# EAGLE design 180V_StepUp (EAGLE 9.6.2)

## Sheet 1 of 3
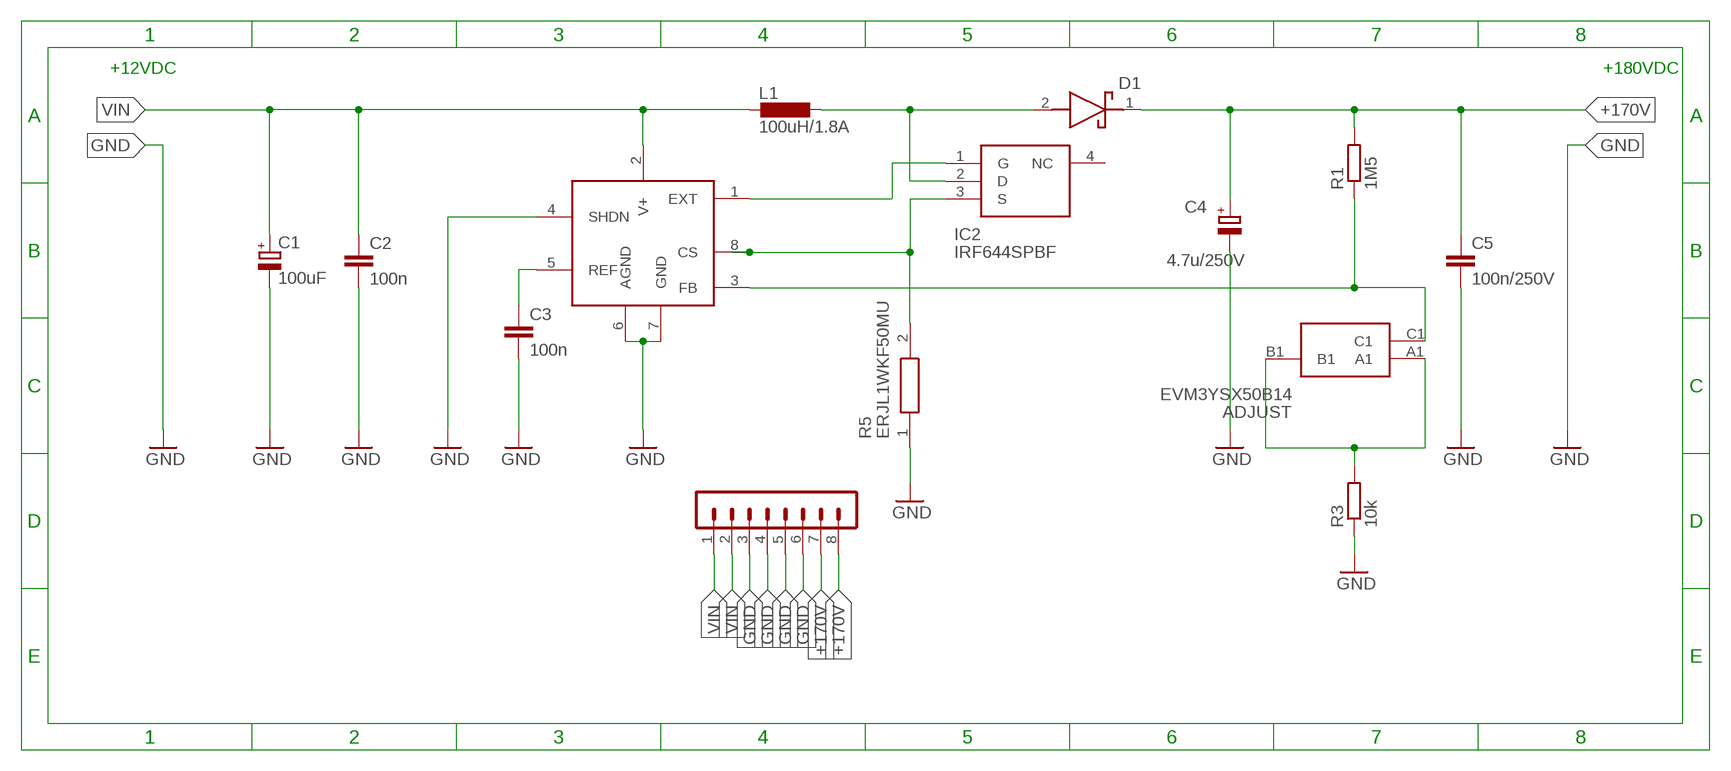
[diagram p0: schematic, sheet 1]

### Parts
ADJUST  EVM3YSX50B14  [EVM3YSX50B14]
C1  100uF  CPOL-EUE2-4  [E2-4]
C2  100n  C-EUC0805  [C0805]
C3  100n  C-EUC0805  [C0805]
C4  4.7u/250V  CPOL-EUE2.5-7  [E2,5-7]
C5  100n/250V  C-EUC2225K  [C2225K]
D1  LSM115JE3_TR13  [DIOM5436X330N]
IC1  MAX1771  [SO08]
IC2  IRF644SPBF  [TO254P1524X483-4N]
L1  100uH/1.8A  DO3316P  [DO3316P]
R1  1M5  R-EU_R0805  [R0805]
R3  10k  R-EU_R0805  [R0805]
R5  ERJL1WKF50MU  [RESC6432X120N]
SV1  PINHEADER-1X8  [MA08-1]

### Nets
+170V: C4.+ C5.1 D1.1(K) R1.2 SV1.7 SV1.8
GND: C1.- C2.2 C3.2 C4.- C5.2 IC1.4(SHDN) IC1.6(AGND) IC1.7(GND) R3.1 R5.1 SV1.3 SV1.4 SV1.5 SV1.6
N$2: D1.2(A) IC2.2(D) L1.2
N$3: C3.1 IC1.5(REF)
N$4: IC1.1(EXT) IC2.1(G)
N$5: IC1.8(CS) IC2.3(S) R5.2
N$6: ADJUST.C1 IC1.3(FB) R1.1
N$7: ADJUST.A1 ADJUST.B1 R3.2
VIN: C1.+ C2.1 IC1.2(V+) L1.1 SV1.1 SV1.2
Unconnected: IC2.4(NC)

### Notes on the sheet
- +12VDC | +180VDC

## Sheet 2 of 3
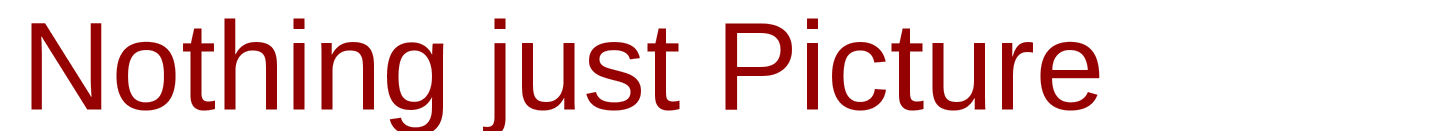
[diagram p1: schematic, sheet 2]

### Notes on the sheet
- Nothing just Picture

## Sheet 3 of 3

## Library data of the parts
ADJUST = CommonParts:EVM3YSX50B14: SMD Cermet Trimmer Pot, 3mm Sq, 10K Source: Datasheet; DESCRIPTION: SMD Cermet Trimmer Pot, 3mm Sq, 10K; HEIGHT: 1.55mm; MANUFACTURER_NAME: Panasonic; MANUFACTURER_PART_NUMBER: EVM3YSX50B14
C1 C4 = rcl:CPOL-EU: POLARIZED CAPACITOR, European symbol; SPICEPREFIX: C
C2 C3 C5 = rcl:C-EU: CAPACITOR, European symbol; SPICEPREFIX: C
D1 = CommonParts:LSM115JE3_TR13: Schottky Diodes & Rectifiers Schottky Source: Datasheet <https://componentsearchengine.com/Datasheets/1/LSM115JE3_TR13.pdf>; DESCRIPTION: Schottky Diodes & Rectifiers Schottky; HEIGHT: 3.3mm; MANUFACTURER_NAME: Microsemi Corporation; MANUFACTURER_PART_NUMBER: LSM115JE3/TR13; MOUSER_PART_NUMBER: 494-LSM115JE3/TR13; MOUSER_PRICE-STOCK: https://www.mouser.com/Search/Refine.aspx?Keyword=494-LSM115JE3%2FTR13
IC1 = nixie_clock:MAX1771
IC2 = MouserUseful:IRF644SPBF: IRF644SPBF, N-channel MOSFET Transistor 14 A 250 V, 3-Pin D2PAK Source: Datasheet <http://www.vishay.com/docs/91040/91040.pdf>; DESCRIPTION: IRF644SPBF, N-channel MOSFET Transistor 14 A 250 V, 3-Pin D2PAK; HEIGHT: 4.83mm; MANUFACTURER_NAME: Vishay; MANUFACTURER_PART_NUMBER: IRF644SPBF; MOUSER_PART_NUMBER: 844-IRF644SPBF; MOUSER_PRICE-STOCK: https://www.mouser.co.uk/ProductDetail/Vishay-Semiconductors/IRF644SPBF/?qs=cvaI6ThkwxsO%2F0AjDnaNgA%3D%3D
L1 = nixie_clock:DO3316P: COILCRAFT; OC_FARNELL: unknown; OC_NEWARK: unknown
R1 R3 = rcl:R-EU_: RESISTOR, European symbol; SPICEPREFIX: R
R5 = MouserUseful:ERJL1WKF50MU: RESISTOR, 2512 50 mOhm +/-1% 1W Source: Datasheet <http://componentsearchengine.com/Datasheets/1/ERJ-L1WKF50MU.pdf>; DESCRIPTION: RESISTOR, 2512 50 mOhm +/-1% 1W; HEIGHT: 1.2mm; MANUFACTURER_NAME: Panasonic; MANUFACTURER_PART_NUMBER: ERJL1WKF50MU
SV1 = CommonParts:PINHEADER-1X8: PIN HEADER; OC_FARNELL: unknown; OC_NEWARK: unknown

## Board
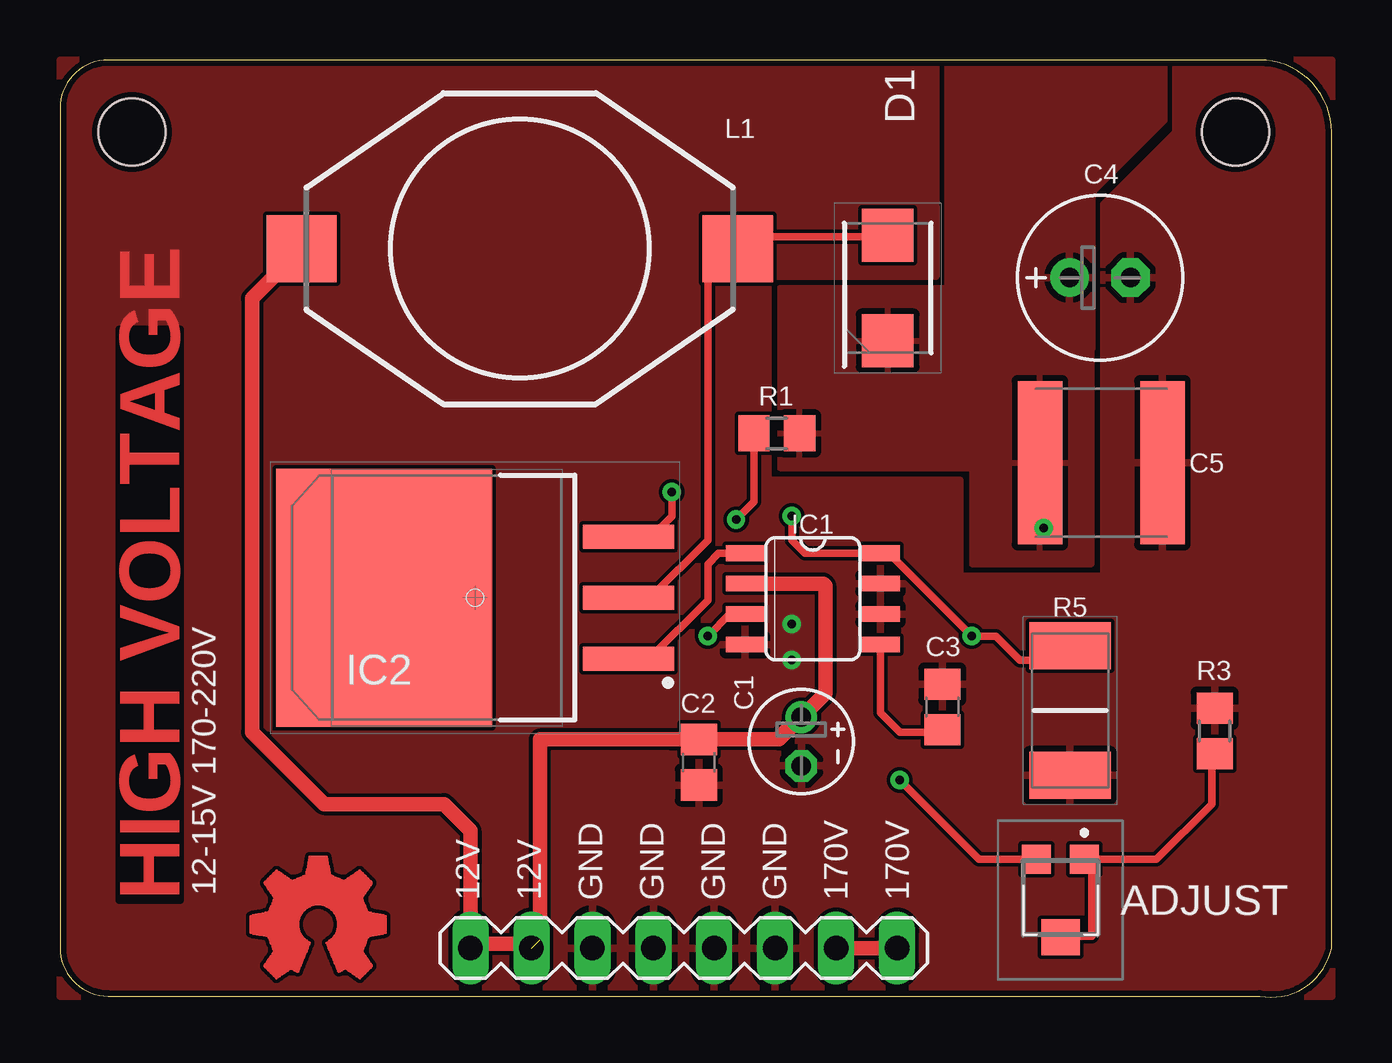
[diagram p2: board, top side]
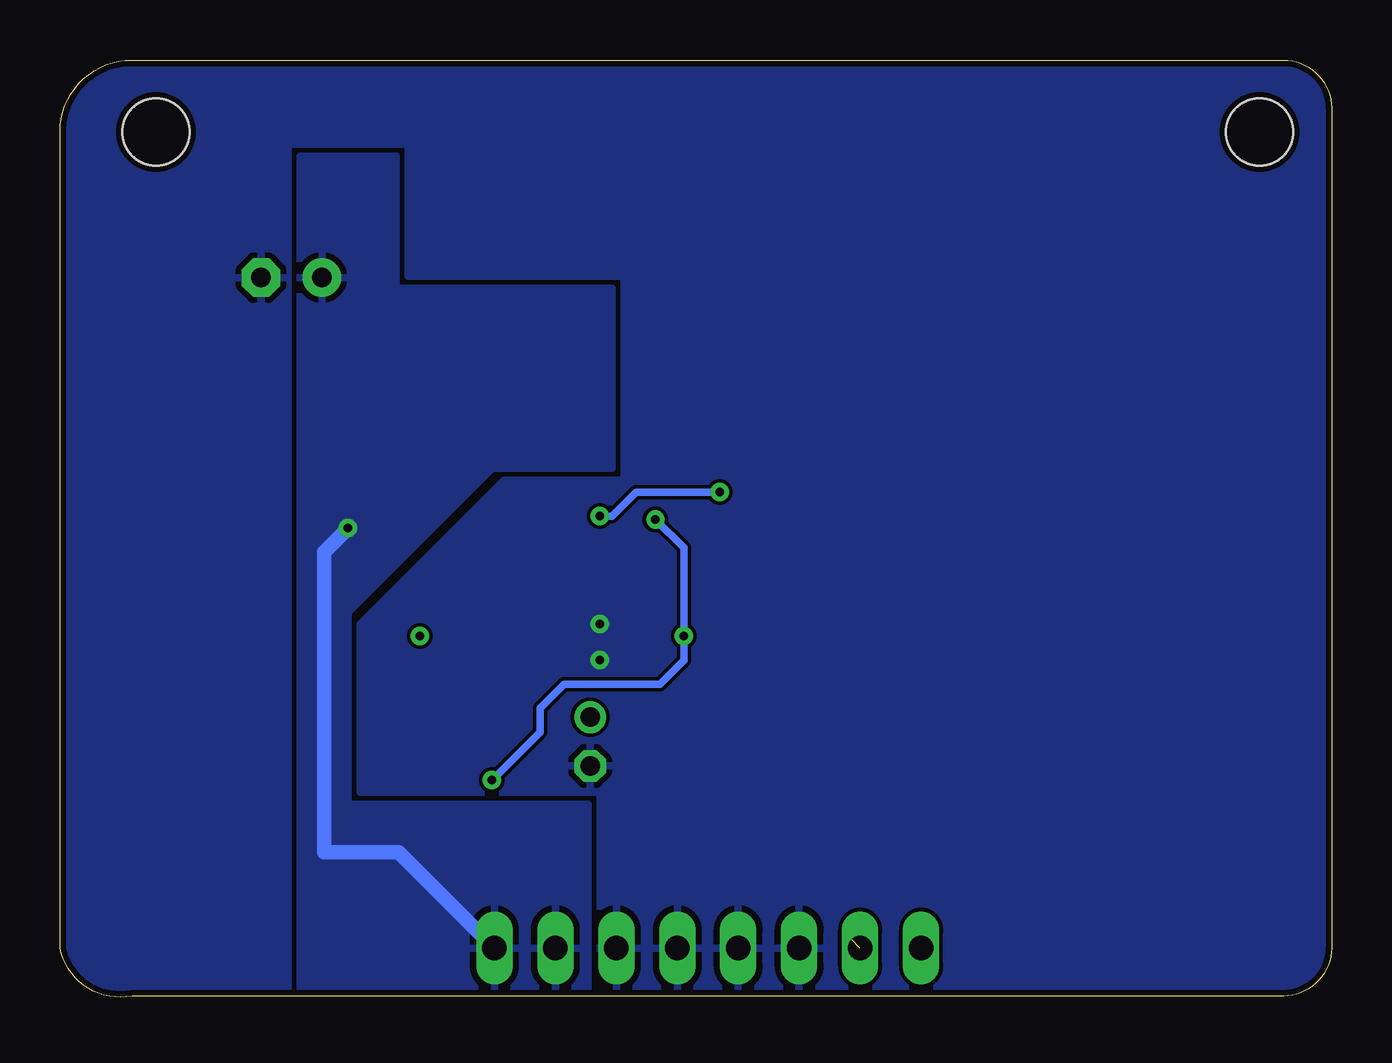
[diagram p3: board, bottom side, seen from below]

Size 53 x 39.05 mm. Coordinates in mm from the lower left corner, seen from the top.
Outline: 53,2.05 53,36.05 arc90 50,39.05 2,39.05 arc90 0,37.05 0,2.05 arc90 2,0.05 50,0.05 arc90 53,2.05
Copper layers (1*16): Top 0.035mm / dielectric 1.5mm / Bottom 0.035mm
Design rules "default *": minimum track width 6mil, minimum drill 0.35mm, track to track 6mil, track to pad 6mil, pad to pad 6mil, via to via 6mil, smd to smd 6mil, copper to edge 10mil, drill to drill 6mil, minimum pad ring 10mil, minimum via ring 8mil, stop-mask expansion 4mil, vias tented up to drill 0mil, thermal gap 10mil
Holes 2.8 mm at 3,36.05 49,36.05

### Footprints (pad centres in the part's own frame; a part is rotated, then mirrored left to right if it is on the bottom)
EVM3YSX50B14 = smd 1.2 x 1.2: A1 -1,-1.6; C1 1,-1.6 | smd 1.6 x 1.5: B1 0,1.65
E2-4 = drill 0.813 pad 1.27: + -1.016,0 | drill 0.813 pad 1.27 octagon: - 1.016,0
C0805 = smd 1.3 x 1.5: 1 -0.95,0; 2 0.95,0
E2,5-7 = drill 0.813 pad 1.6: + -1.27,0 | drill 0.813 pad 1.6 octagon: - 1.27,0
C2225K = smd 1.85 x 6.8: 1 -2.55,0; 2 2.55,0
DIOM5436X330N = smd 2.2 x 2.15: 1 -2.2,0; 2 2.2,0
SO08 = smd 0.66 x 1.6: 1 -1.905,-2.823; 2 -0.635,-2.823; 3 0.635,-2.823; 4 1.905,-2.823; 5 1.905,2.823; 6 0.635,2.823; 7 -0.635,2.823; 8 -1.905,2.823
TO254P1524X483-4N = smd 3.8 x 1: 1 -6.4,2.54; 2 -6.4,0; 3 -6.4,-2.54 | smd 9 x 10.75: 4 3.8,0
DO3316P = smd 2.92 x 2.79: 1 -9.09,0; 2 9.09,0
R0805 = smd 1.3 x 1.5: 1 -0.95,0; 2 0.95,0
RESC6432X120N = smd 1.95 x 3.4: 1 -2.7,0; 2 2.7,0
MA08-1 = drill 1.016 long: 1 -8.89,0; 2 -6.35,0; 3 -3.81,0; 4 -1.27,0; 5 1.27,0; 6 3.81,0; 7 6.35,0; 8 8.89,0

### Placement (x,y rotation side)
ADJUST  41.7,4.15 180 top
C1  30.9,10.65 270 top
C2  26.63,9.79 270 top
C3  36.78,12.09 90 top
C4  43.35,29.98 0 top
C5  43.4,22.27 0 top
D1  34.5,29.55 90 top
IC1  31.38,16.6 270 top
IC2  17.3,16.65 180 top
L1  19.16,31.19 0 top
R1  29.88,23.49 0 top
R3  48.13,11.09 270 top
R5  42.1,11.95 90 top
SV1  26,2.05 0 top

### Tracks (layer width: path | path; a pad name or v marks a point on that pad's centre or on a via)
+170V  (via drill 0.35)
  Top 0.61: SV1.7 SV1.8
  Bottom 0.61: SV1.8 38.89,6.05 42,6.05 42,18.55 v41,19.55
  pour Top: 30,29.55 30,22.05 38,22.05 38,18.05 43,18.05 43,29.55
  pour Top: 43,27.05 43,33.55 46,36.55 46,39.05 37,39.05 37,27.05
  pour Bottom: 43,35.05 43,0.05 31,0.05 31,8.05 41,8.05 41,16.05 35,22.05 30,22.05 30,29.55 39,29.55 39,35.05
GND  (via drill 0.35)
  other vias: 30.5,15.55 30.5,14.05
  pour Top: 36.5,39.05 36.5,30.05 29.5,30.05 29.5,21.55 37.5,21.55 37.5,17.55 43.5,17.55 43.5,33.05 46.5,36.05 46.5,39.05 53,39.05 53,0.05 0,0.05 0,39.05
  pour Bottom: 38.5,35.55 43.5,35.55 43.5,0.05 53,0.05 53,39.05 0,39.05 0,0.05 30.5,0.05 30.5,8.55 40.5,8.55 40.5,15.55 34.5,21.55 29.5,21.55 29.5,30.05 38.5,30.05
N$2
  Top 0.152: D1.2 34.56,31.69
  Top 0.305: IC2.2 24.6,16.65 27,19.05 27,29.94 L1.2 28.25,31.69 34.56,31.69
N$3
  Top 0.305: C3.1 36.69,11.05 35,11.05 34.2,11.85 IC1.5
N$4
  Top 0.305: IC2.1 24.56,14.11 27,16.55 27,18.05 27.45,18.5 IC1.1
N$5  (via drill 0.35)
  Top 0.305: IC2.3 24.64,19.19 25.5,20.05 v25.5,21.05 | R5.2 42.1,14.15 42,14.05 40,14.05 39,15.05 v38,15.05 34.55,18.5 IC1.8 31.05,18.5 30.5,19.05 v30.5,20.05
  Bottom 0.305: v30.5,20.05 30,20.05 29,21.05 v25.5,21.05
N$6  (via drill 0.35)
  Top 0.305: ADJUST.C1 38.3,5.75 v35,9.05 | v27,15.05 27.91,15.96 IC1.3 | v28.18,19.9 28.93,20.65 R1.1
  Bottom 0.305: v35,9.05 33,11.05 33,12.05 32,13.05 28,13.05 27,14.05 v27,15.05 27,18.72 v28.18,19.9
N$7
  Top 0.305: R3.2 48,10.01 48,8.05 45.7,5.75 43,5.75 | 43,5.75 ADJUST.A1 | ADJUST.B1 41.75,2.55 43,2.55 43,5.75
VIN  (1 unrouted)
  Top 0.305: C1.+ 31,11.77 31,12.05 29.69,10.74 C2.1 25.5,10.74
  Top 0.61: L1.1 8,29.12 8,11.05 11,8.05 16,8.05 17.11,6.94 SV1.1 17.29,2.22 19.82,2.22 SV1.2 | 20,2.4 20,10.74 25.5,10.74 26.5,10.74 | C2.1 29.97,10.74 C1.+ 31.9,12.67 31.9,17.15 31.82,17.23 IC1.2
(copper drawn outside any net)
  shapes: Top area x369

### Text on the board
Top: HIGH VOLTAGE
tNames: 12-15V 170-220V | 12V | 12V | GND | GND | GND | GND | 170V | 170V
tStop: HIGH VOLTAGE